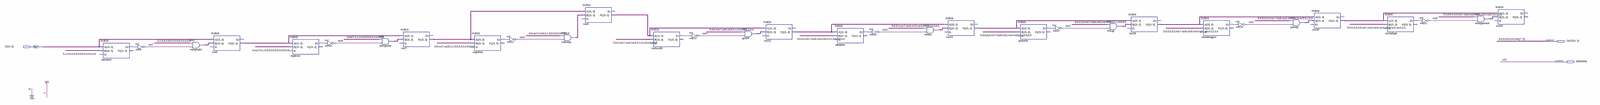
[diagram p0: schematic sheet, whole]
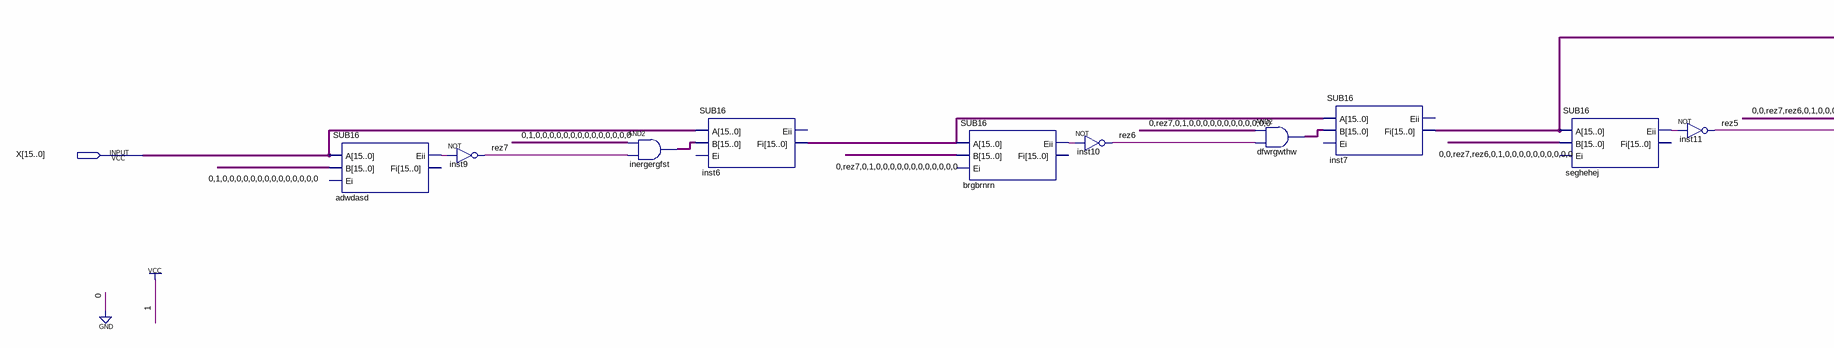
[diagram p1: schematic sheet, left part]
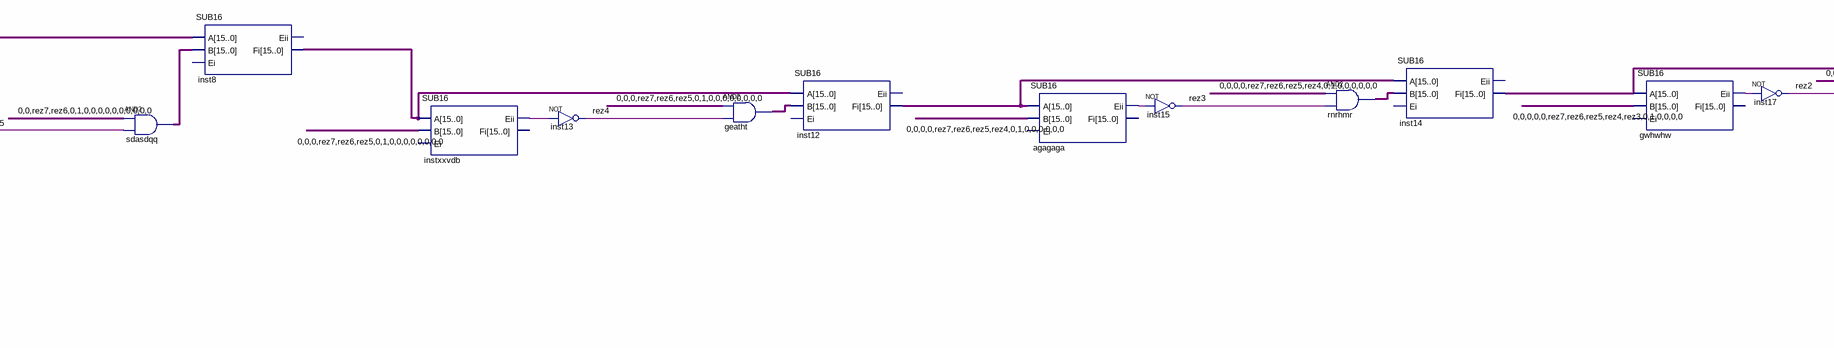
[diagram p2: schematic sheet, centre part]
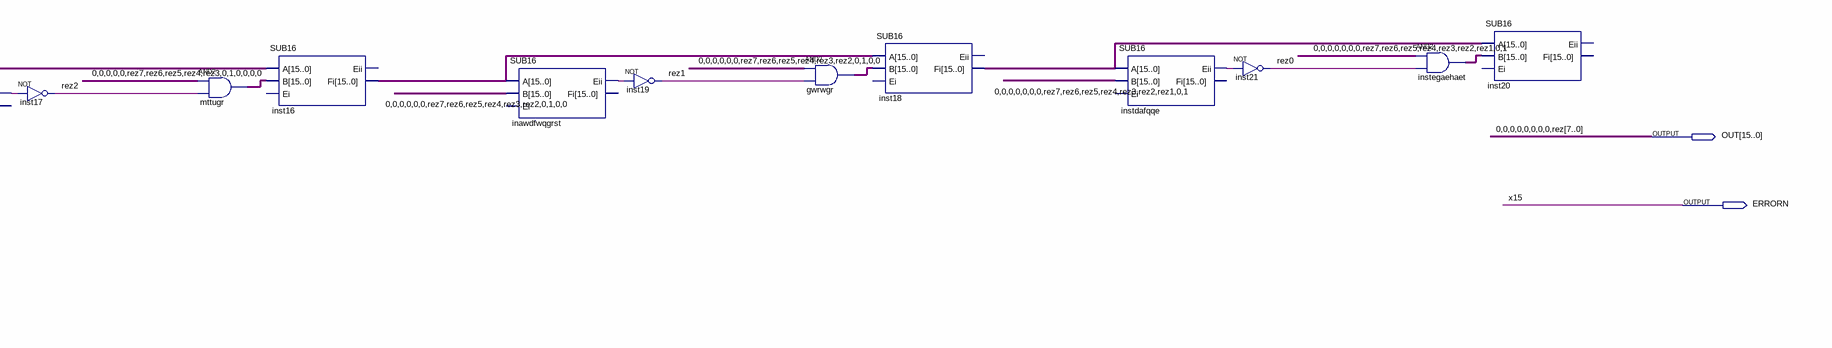
[diagram p3: schematic sheet, right part]
// Quartus schematic SQRT.bdf as structural Verilog: 32 symbols, 3 pins
module SQRT (
  input  [15:0] X,
  output [15:0] OUT,
  output ERRORN
);

  wire adwdasd_eii, agagaga_eii, brgbrnrn_eii, gwhwhw_eii, inawdfwqgrst_eii, instdafqqe_eii, instxxvdb_eii,
       seghehej_eii;
  wire [15:0] dfwrgwthw_out, geatht_out, gwrwgr_out, inergergfst_out, inst6_fi, inst7_fi, inst8_fi,
       inst12_fi, inst14_fi, inst16_fi, inst18_fi, instegaehaet_out, mttugr_out, rnrhmr_out, sdasdqq_out;

  SUB16 adwdasd (.A(X), .B(16'b0100000000000000), .Eii(adwdasd_eii));  // open: Ei, Fi
  not inst9 (OUT[7], adwdasd_eii);
  assign inergergfst_out = 16'b0100000000000000 & {16{OUT[7]}};  // AND2 inergergfst, 16 bits wide
  SUB16 inst6 (.A(X), .B(inergergfst_out), .Fi(inst6_fi));  // open: Ei, Eii
  SUB16 brgbrnrn (.A(inst6_fi), .B({1'b0, OUT[7], 14'b01000000000000}), .Eii(brgbrnrn_eii));  // open: Ei, Fi
  not inst10 (OUT[6], brgbrnrn_eii);
  assign dfwrgwthw_out = {1'b0, OUT[7], 14'b01000000000000} & {16{OUT[6]}};  // AND2 dfwrgwthw, 16 bits wide
  SUB16 inst7 (.A(inst6_fi), .B(dfwrgwthw_out), .Fi(inst7_fi));  // open: Ei, Eii
  SUB16 seghehej (.A(inst7_fi), .B({2'b00, OUT[7:6], 12'b010000000000}), .Eii(seghehej_eii));  // open: Ei, Fi
  not inst11 (OUT[5], seghehej_eii);
  assign sdasdqq_out = {2'b00, OUT[7:6], 12'b010000000000} & {16{OUT[5]}};  // AND2 sdasdqq, 16 bits wide
  SUB16 inst8 (.A(inst7_fi), .B(sdasdqq_out), .Fi(inst8_fi));  // open: Ei, Eii
  SUB16 instxxvdb (.A(inst8_fi), .B({3'b000, OUT[7:5], 10'b0100000000}), .Eii(instxxvdb_eii));  // open: Ei, Fi
  not inst13 (OUT[4], instxxvdb_eii);
  assign geatht_out = {3'b000, OUT[7:5], 10'b0100000000} & {16{OUT[4]}};  // AND2 geatht, 16 bits wide
  SUB16 inst12 (.A(inst8_fi), .B(geatht_out), .Fi(inst12_fi));  // open: Ei, Eii
  SUB16 agagaga (.A(inst12_fi), .B({4'b0000, OUT[7:4], 8'b01000000}), .Eii(agagaga_eii));  // open: Ei, Fi
  not inst15 (OUT[3], agagaga_eii);
  assign rnrhmr_out = {4'b0000, OUT[7:4], 8'b01000000} & {16{OUT[3]}};  // AND2 rnrhmr, 16 bits wide
  SUB16 inst14 (.A(inst12_fi), .B(rnrhmr_out), .Fi(inst14_fi));  // open: Ei, Eii
  SUB16 gwhwhw (.A(inst14_fi), .B({{5{1'b0}}, OUT[7:3], 6'b010000}), .Eii(gwhwhw_eii));  // open: Ei, Fi
  not inst17 (OUT[2], gwhwhw_eii);
  assign mttugr_out = {{5{1'b0}}, OUT[7:3], 6'b010000} & {16{OUT[2]}};  // AND2 mttugr, 16 bits wide
  SUB16 inst16 (.A(inst14_fi), .B(mttugr_out), .Fi(inst16_fi));  // open: Ei, Eii
  SUB16 inawdfwqgrst (.A(inst16_fi), .B({{6{1'b0}}, OUT[7:2], 4'b0100}), .Eii(inawdfwqgrst_eii));  // open: Ei, Fi
  not inst19 (OUT[1], inawdfwqgrst_eii);
  assign gwrwgr_out = {{6{1'b0}}, OUT[7:2], 4'b0100} & {16{OUT[1]}};  // AND2 gwrwgr, 16 bits wide
  SUB16 inst18 (.A(inst16_fi), .B(gwrwgr_out), .Fi(inst18_fi));  // open: Ei, Eii
  SUB16 instdafqqe (.A(inst18_fi), .B({{7{1'b0}}, OUT[7:1], 2'b01}), .Eii(instdafqqe_eii));  // open: Ei, Fi
  not inst21 (OUT[0], instdafqqe_eii);
  assign instegaehaet_out = {{7{1'b0}}, OUT[7:1], 2'b01} & {16{OUT[0]}};  // AND2 instegaehaet, 16 bits wide
  SUB16 inst20 (.A(inst18_fi), .B(instegaehaet_out));  // open: Ei, Eii, Fi

  assign ERRORN = X[15];
  assign OUT[15:8] = {8{1'b0}};

  // Other names for the same wires on the sheet: rez[7:0] = OUT[7:0]; rez0 = OUT[0]; rez1 = OUT[1]; rez2 = OUT[2];
  //   rez3 = OUT[3]; rez4 = OUT[4]; rez5 = OUT[5]; rez6 = OUT[6]; rez7 = OUT[7]
endmodule
